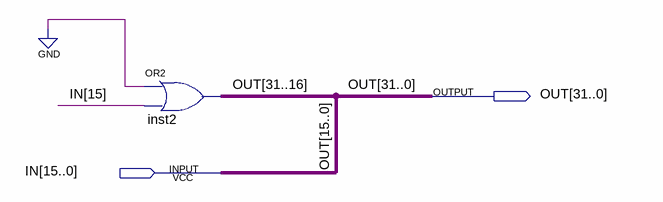
[diagram p0: schematic sheet]
// Quartus schematic signextend.bdf as structural Verilog: 1 symbols, 2 pins
module signextend (
  input  [15:0] IN,
  output [31:0] OUT
);

  assign OUT[31:16] = {16{1'b0}} | {16{IN[15]}};  // OR2 inst2, 16 bits wide

  assign OUT[15:0] = IN;
endmodule
